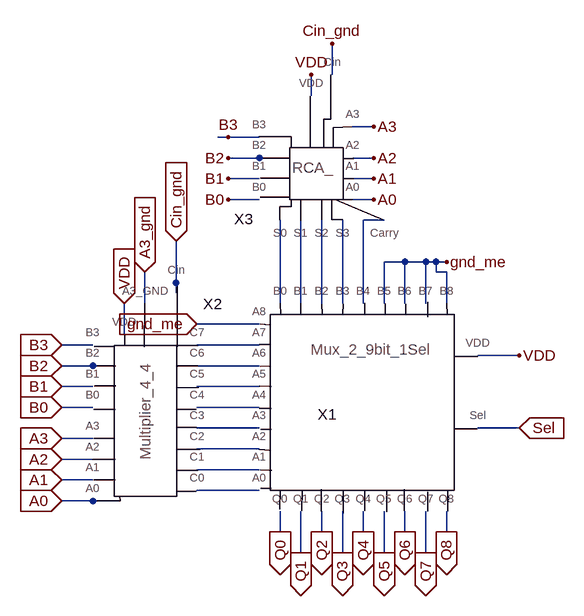
[diagram p0: schematic MUX_Mult_Adder.asc]
MUX_Mult_Adder.asc, the LTspice schematic file:
Version 4
SHEET 1 880 680
WIRE 192 -288 192 -336
WIRE 160 -256 160 -288
WIRE 256 -208 224 -208
WIRE 32 -192 16 -192
WIRE 80 -192 32 -192
WIRE 80 -160 32 -160
WIRE 96 -160 80 -160
WIRE 256 -160 224 -160
WIRE 80 -128 32 -128
WIRE 256 -128 224 -128
WIRE 80 -96 32 -96
WIRE 256 -96 224 -96
WIRE 272 -64 240 -64
WIRE 304 0 272 0
WIRE 336 0 304 0
WIRE 352 0 336 0
WIRE 368 0 352 0
WIRE 352 16 352 0
WIRE 368 16 352 16
WIRE -48 32 -48 -32
WIRE -48 48 -48 32
WIRE -96 64 -96 16
WIRE 112 64 112 -64
WIRE 144 64 144 -64
WIRE 176 64 176 -64
WIRE 208 64 208 -64
WIRE 240 64 240 -64
WIRE 272 64 272 0
WIRE 304 64 304 0
WIRE 336 64 336 0
WIRE 368 64 368 16
WIRE 80 96 -16 96
WIRE -128 112 -128 64
WIRE -176 128 -224 128
WIRE 80 128 -16 128
WIRE 480 144 416 144
WIRE -176 160 -224 160
WIRE -160 160 -176 160
WIRE 80 160 -16 160
WIRE -176 192 -224 192
WIRE 80 192 -16 192
WIRE -176 224 -224 224
WIRE 80 224 -16 224
WIRE 80 256 -16 256
WIRE 480 256 416 256
WIRE -176 272 -224 272
WIRE 80 288 -16 288
WIRE -176 304 -224 304
WIRE 80 320 -16 320
WIRE -176 336 -224 336
WIRE 80 352 -16 352
WIRE -176 368 -224 368
WIRE -160 368 -176 368
WIRE 112 416 112 384
WIRE 176 416 176 384
WIRE 240 416 240 384
WIRE 304 416 304 384
WIRE 368 416 368 384
WIRE 144 448 144 384
WIRE 208 448 208 384
WIRE 272 448 272 384
WIRE 336 448 336 384
FLAG -224 128 B3
IOPIN -224 128 In
FLAG -224 160 B2
IOPIN -224 160 In
FLAG -224 192 B1
IOPIN -224 192 In
FLAG -224 224 B0
IOPIN -224 224 In
FLAG 32 -192 B3
FLAG 32 -160 B2
FLAG 32 -128 B1
FLAG 32 -96 B0
FLAG -224 272 A3
IOPIN -224 272 In
FLAG -224 304 A2
IOPIN -224 304 In
FLAG -224 336 A1
IOPIN -224 336 In
FLAG -224 368 A0
IOPIN -224 368 In
FLAG 256 -208 A3
FLAG 256 -160 A2
FLAG 256 -128 A1
FLAG 256 -96 A0
FLAG -48 -32 Cin_gnd
IOPIN -48 -32 In
FLAG 192 -336 Cin_gnd
FLAG -96 16 A3_gnd
IOPIN -96 16 In
FLAG -128 64 VDD
IOPIN -128 64 In
FLAG 160 -288 VDD
FLAG 480 144 VDD
FLAG 480 256 Sel
IOPIN 480 256 In
FLAG -16 96 gnd_me
IOPIN -16 96 In
FLAG 368 0 gnd_me
FLAG 112 416 Q0
IOPIN 112 416 Out
FLAG 144 448 Q1
IOPIN 144 448 Out
FLAG 176 416 Q2
IOPIN 176 416 Out
FLAG 208 448 Q3
IOPIN 208 448 Out
FLAG 240 416 Q4
IOPIN 240 416 Out
FLAG 272 448 Q5
IOPIN 272 448 Out
FLAG 304 416 Q6
IOPIN 304 416 Out
FLAG 336 448 Q7
IOPIN 336 448 Out
FLAG 368 416 Q8
IOPIN 368 416 Out
SYMBOL MUX_2_9bit_1 272 160 R0
SYMATTR InstName X1
SYMBOL Mult_4_4 -64 224 R0
SYMATTR InstName X2
SYMBOL RCA_ 176 -96 M0
SYMATTR InstName X3

The netlist it stands for:
* MUX_Mult_Adder.asc
XX1 N012 N011 N010 N009 N008 N007 N006 gnd_me N013 N003 N004 N005 N001 gnd_me gnd_me gnd_me gnd_me N002 Q1 Q2 Q3 Q4 Q5 Q6 Q7 Q8 Q0 VDD Sel MUX_2_9bit_1  ; pins A1 A2 A3 A4 A5 A6 A7 A8 A0 B1 B2 B3 B4 B5 B6 B7 B8 B0 Q1 Q2 Q3 Q4 Q5 Q6 Q7 Q8 Q0 VDD Sel
XX2 A0 A1 A2 A3 B0 B1 VDD A3_gnd Cin_gnd N008 N009 N010 N011 N012 N013 B2 N007 B3 N006 Mult_4_4  ; pins A0 A1 A2 A3 B0 B1 VDD A3_GND Cin C5 C4 C3 C2 C1 C0 B2 C6 B3 C7
XX3 A3 A2 A1 A0 N005 N004 N003 N002 N001 B3 B2 VDD B1 B0 Cin_gnd RCA_  ; pins A3 A2 A1 A0 S3 S2 S1 S0 Carry B3 B2 VDD B1 B0 Cin
.backanno
.end